# Altium schematic sheet TOP.SchDoc
size A3; SheetNumber: 1; SheetTotal: 2
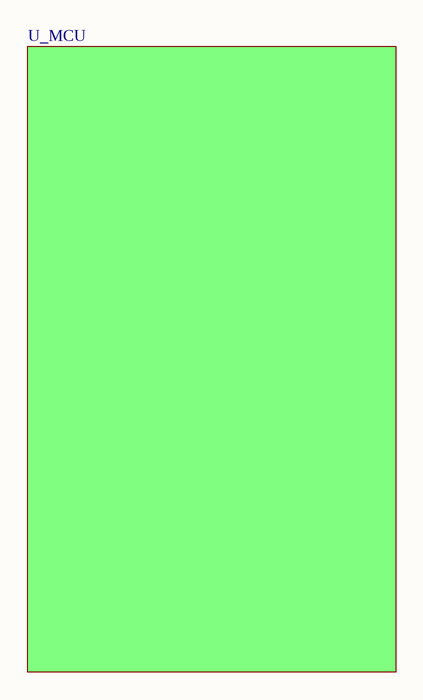
[diagram p0: TOP.SchDoc]

## Sub-sheets
U_MCU = MCU.SchDoc: no entries